# Altium schematic sheet Unified_Interface.SchDoc: Evaluation Board 3.2
size A3; Organization: Toradex AG; Address1: Altsagenstrasse 5; Address2: Horw; Address3: 6048; Address4: Switzerland; DocumentNumber: 16; Revision: V3.2; SheetNumber: 16; SheetTotal: 23; PageSetup: Record=PageOptions|CenterHorizontal=True|CenterVertical=True|PrintScale=0.73|XCorrection=1.00|YCorrection=1.00|PrintKind=0|BorderSize=5000000|LeftOffset=0|BottomOffset=0|Orientation=2|PaperLength=1000|PaperWidth=1000|Scale=100|PaperSource=7|PrintQuality=-4|MediaType=1|DitherType=10|PaperKind=A4|PrintScaleMode=1
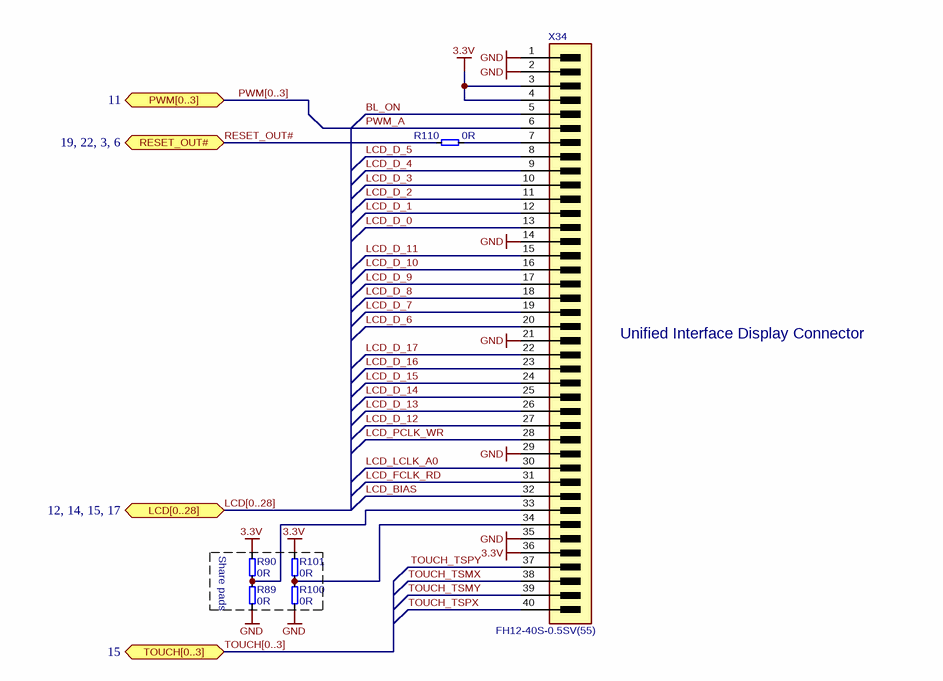
[diagram p0: Unified_Interface.SchDoc]

## Parts
R89  0R  [T_RESC0603X30N]
R90  0R  [T_RESC0603X30N]
R100  0R  [T_RESC0603X30N]
R101  0R  [T_RESC0603X30N]
R110  0R  [T_RESC0603X30N]
X34  FH12-40S-0.5SV(55)  [T_Hirose_FH12-40S-0.5SV(55)]

## Blocks framed on the sheet
Share pads: R89 R90 R100 R101

## Ports
LCD[0..28] (bidir, see 12, 14, 15, 17), PWM[0..3] (bidir, see 11), RESET_OUT# (bidir, see 19, 22, 3, 6), TOUCH[0..3] (bidir, see 15)

## Nets
3.3V: R90.1 R101.2 X34.3(VCC) X34.4(VCC) X34.36(VDD)
GND: R89.2 R100.2 X34.1(VSS) X34.2(VSS) X34.14(VSS) X34.21(VSS) X34.29(VSS) X34.35(VSS)
BL_ON: X34.5(PWCTRL)
LCD_BIAS: X34.32(ENB)
LCD_D_0: X34.13(B0)
LCD_D_1: X34.12(B1)
LCD_D_2: X34.11(B2)
LCD_D_3: X34.10(B3)
LCD_D_4: X34.9(B4)
LCD_D_5: X34.8(B5)
LCD_D_6: X34.20(G0)
LCD_D_7: X34.19(G1)
LCD_D_8: X34.18(G2)
LCD_D_9: X34.17(G3)
LCD_D_10: X34.16(G4)
LCD_D_11: X34.15(G5)
LCD_D_12: X34.27(R0)
LCD_D_13: X34.26(R1)
LCD_D_14: X34.25(R2)
LCD_D_15: X34.24(R3)
LCD_D_16: X34.23(R4)
LCD_D_17: X34.22(R5)
LCD_FCLK_RD: X34.31(VSYNC)
LCD_LCLK_A0: X34.30(HSYNC)
LCD_PCLK_WR: X34.28(DCLK)
PWM_A: X34.6(LEDCTRL)
RESET_OUT#: R110.1 ; port RESET_OUT#
TOUCH_TSMX: X34.38(XR)
TOUCH_TSMY: X34.39(YD)
TOUCH_TSPX: X34.40(XL)
TOUCH_TSPY: X34.37(YU)
NetR89_1: R89.1 R90.2 X34.33(NC)
NetR100_1: R100.1 R101.1 X34.34(SHUT)
NetR110_2: R110.2 X34.7(RESET#)

## Buses and harness runs
bus LCD[0..28] = port LCD[0..28]
bus PWM[0..3] = port PWM[0..3]
bus TOUCH[0..3] = port TOUCH[0..3]

## Notes on the sheet
- Unified Interface Display Connector
- Title
- Size:
- Date:
- A3
- Number:
- Time:
- Revision:
- Sheet
- of
- File:

## Library data of the parts
R89 R90 R100 R101 R110 = R-0R-63mW-1%-0603: Resistor 0 ohm 63mW 1% 0603; Rating: 63mW; Tolerance: 1%; Value: 0R
X34 = CON-Hirose-FH12-40S-0.5SV(55)-0.5mm: 0.50mm Pitch FFC/FPC Vertical RGB connector; Manufacturer Name: Hirose; No. of ways: 24; Pitch: 0.5mm; Manufacturer Part No.: FH12-40S-0.5SV(55)